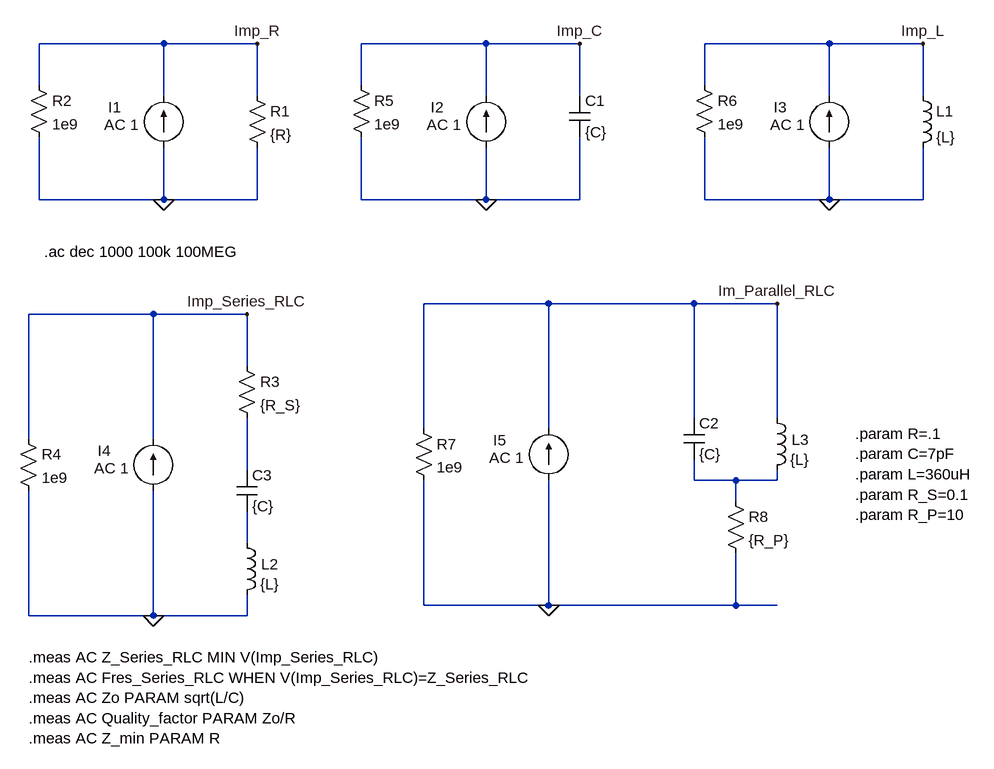
[diagram p0: schematic Impedance_ideal_RLC.asc]
Impedance_ideal_RLC.asc, the LTspice schematic file:
Version 4
SHEET 1 2600 1068
WIRE 0 -16 -192 -16
WIRE 144 -16 0 -16
WIRE 496 -16 304 -16
WIRE 640 -16 496 -16
WIRE 1024 -16 832 -16
WIRE 1168 -16 1024 -16
WIRE -192 48 -192 -16
WIRE 304 48 304 -16
WIRE 832 48 832 -16
WIRE 0 64 0 -16
WIRE 144 64 144 -16
WIRE 496 64 496 -16
WIRE 640 64 640 -16
WIRE 1024 64 1024 -16
WIRE 1168 64 1168 -16
WIRE -192 224 -192 128
WIRE 0 224 0 144
WIRE 0 224 -192 224
WIRE 144 224 144 144
WIRE 144 224 0 224
WIRE 304 224 304 128
WIRE 496 224 496 144
WIRE 496 224 304 224
WIRE 640 224 640 128
WIRE 640 224 496 224
WIRE 832 224 832 128
WIRE 1024 224 1024 144
WIRE 1024 224 832 224
WIRE 1168 224 1168 144
WIRE 1168 224 1024 224
WIRE 592 384 400 384
WIRE 816 384 592 384
WIRE 944 384 816 384
WIRE -16 400 -208 400
WIRE 128 400 -16 400
WIRE 128 480 128 400
WIRE 816 560 816 384
WIRE 944 560 944 384
WIRE 400 576 400 384
WIRE 592 576 592 384
WIRE -208 592 -208 400
WIRE -16 592 -16 400
WIRE 128 640 128 560
WIRE 816 656 816 624
WIRE 880 656 816 656
WIRE 944 656 944 640
WIRE 944 656 880 656
WIRE 880 688 880 656
WIRE 128 752 128 704
WIRE 400 848 400 656
WIRE 592 848 592 656
WIRE 592 848 400 848
WIRE 880 848 880 768
WIRE 880 848 592 848
WIRE 944 848 880 848
WIRE -208 864 -208 672
WIRE -16 864 -16 672
WIRE -16 864 -208 864
WIRE 128 864 128 832
WIRE 128 864 -16 864
FLAG 0 224 0
FLAG 496 224 0
FLAG 1024 224 0
FLAG 144 -16 Imp_R
FLAG 640 -16 Imp_C
FLAG 1168 -16 Imp_L
FLAG 128 400 Imp_Series_RLC
FLAG -16 864 0
FLAG 592 848 0
FLAG 944 384 Im_Parallel_RLC
SYMBOL res 128 48 R0
SYMATTR InstName R1
SYMATTR Value {R}
SYMBOL current 0 144 R180
WINDOW 0 65 62 Left 2
WINDOW 3 24 0 Left 2
WINDOW 123 38 35 Left 2
WINDOW 39 0 0 Left 0
SYMATTR InstName I1
SYMATTR Value ""
SYMATTR Value2 AC 1
SYMBOL res -208 32 R0
SYMATTR InstName R2
SYMATTR Value 1e9
SYMBOL current 496 144 R180
WINDOW 0 65 62 Left 2
WINDOW 3 24 0 Left 2
WINDOW 123 38 35 Left 2
WINDOW 39 0 0 Left 0
SYMATTR InstName I2
SYMATTR Value ""
SYMATTR Value2 AC 1
SYMBOL current 1024 144 R180
WINDOW 0 65 62 Left 2
WINDOW 3 24 0 Left 2
WINDOW 123 38 35 Left 2
WINDOW 39 0 0 Left 0
SYMATTR InstName I3
SYMATTR Value ""
SYMATTR Value2 AC 1
SYMBOL res 816 32 R0
SYMATTR InstName R6
SYMATTR Value 1e9
SYMBOL cap 624 64 R0
SYMATTR InstName C1
SYMATTR Value {C}
SYMBOL ind 1152 48 R0
SYMATTR InstName L1
SYMATTR Value {L}
SYMBOL res 112 464 R0
SYMATTR InstName R3
SYMATTR Value {R_S}
SYMBOL current -16 672 R180
WINDOW 0 65 62 Left 2
WINDOW 3 24 0 Left 2
WINDOW 123 38 35 Left 2
WINDOW 39 0 0 Left 0
SYMATTR InstName I4
SYMATTR Value ""
SYMATTR Value2 AC 1
SYMBOL res -224 576 R0
SYMATTR InstName R4
SYMATTR Value 1e9
SYMBOL cap 112 640 R0
SYMATTR InstName C3
SYMATTR Value {C}
SYMBOL ind 112 736 R0
WINDOW 0 38 49 Left 2
SYMATTR InstName L2
SYMATTR Value {L}
SYMBOL res 288 32 R0
SYMATTR InstName R5
SYMATTR Value 1e9
SYMBOL current 592 656 R180
WINDOW 0 65 62 Left 2
WINDOW 3 24 0 Left 2
WINDOW 123 38 35 Left 2
WINDOW 39 0 0 Left 0
SYMATTR InstName I5
SYMATTR Value ""
SYMATTR Value2 AC 1
SYMBOL res 384 560 R0
SYMATTR InstName R7
SYMATTR Value 1e9
SYMBOL res 864 672 R0
SYMATTR InstName R8
SYMATTR Value {R_P}
SYMBOL cap 800 560 R0
SYMATTR InstName C2
SYMATTR Value {C}
SYMBOL ind 928 544 R0
WINDOW 0 38 49 Left 2
SYMATTR InstName L3
SYMATTR Value {L}
TEXT -184 304 Left 2 !.ac dec 1000 100k 100MEG
TEXT -208 928 Left 2 !.meas AC Z_Series_RLC MIN V(Imp_Series_RLC)\n.meas AC Fres_Series_RLC WHEN V(Imp_Series_RLC)=Z_Series_RLC\n.meas AC Zo PARAM sqrt(L/C)\n.meas AC Quality_factor PARAM Zo/R\n.meas AC Z_min PARAM R
TEXT 1064 584 Left 2 !.param R=.1\n.param C=7pF\n.param L=360uH\n.param R_S=0.1\n.param R_P=10

The netlist it stands for:
* Impedance_ideal_RLC.asc
R1 Imp_R 0 {R}
I1 0 Imp_R AC 1
R2 Imp_R 0 1e9
I2 0 Imp_C AC 1
I3 0 Imp_L AC 1
R6 Imp_L 0 1e9
C1 Imp_C 0 {C}
L1 Imp_L 0 {L}
R3 Imp_Series_RLC N001 {R_S}
I4 0 Imp_Series_RLC AC 1
R4 Imp_Series_RLC 0 1e9
C3 N001 N003 {C}
L2 N003 0 {L}
R5 Imp_C 0 1e9
I5 0 Im_Parallel_RLC AC 1
R7 Im_Parallel_RLC 0 1e9
R8 N002 0 {R_P}
C2 Im_Parallel_RLC N002 {C}
L3 Im_Parallel_RLC N002 {L}
.ac dec 1000 100k 100MEG
.meas AC Z_Series_RLC MIN V(Imp_Series_RLC)
.meas AC Fres_Series_RLC WHEN V(Imp_Series_RLC)=Z_Series_RLC
.meas AC Zo PARAM sqrt(L/C)
.meas AC Quality_factor PARAM Zo/R
.meas AC Z_min PARAM R
.param R=.1
.param C=7pF
.param L=360uH
.param R_S=0.1
.param R_P=10
.backanno
.end